# Altium project ACE_LED_Ring_V2.PrjPcb
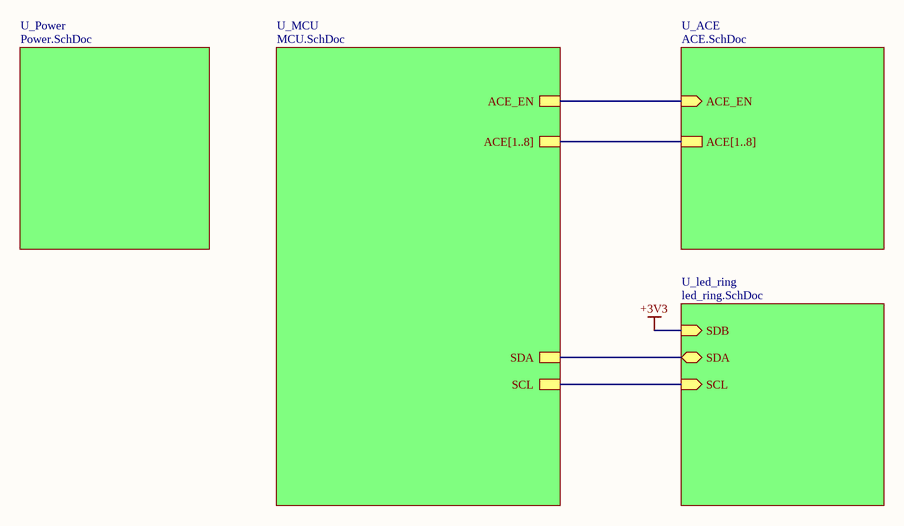
[diagram p0: overview.SchDoc]
5 sheets, 85 parts. Net scope: hierarchical (ports join the sheet entries above them; power ports are global).
Board file: PCB1.PcbDoc
Sheets:
  overview.SchDoc
    U_Power = Power.SchDoc
    U_ACE = ACE.SchDoc
    U_led_ring = led_ring.SchDoc
    U_MCU = MCU.SchDoc

## Sheet overview.SchDoc
size A4

### Sub-sheets
U_ACE = ACE.SchDoc: ACE_EN (in), ACE[1..8]
U_led_ring = led_ring.SchDoc: SDA (bidir), SCL (in), SDB (in)
U_MCU = MCU.SchDoc: ACE[1..8], ACE_EN, SDA, SCL
U_Power = Power.SchDoc: no entries

### Nets
NetB1_1: sheet U_led_ring/SDA, sheet U_MCU/SDA
NetB1_2: sheet U_ACE/ACE_EN, sheet U_MCU/ACE_EN
NetB1_28: sheet U_led_ring/SCL, sheet U_MCU/SCL

### Buses and harness runs
bus sheet U_ACE/ACE[1..8] = sheet U_MCU/ACE[1..8]

## Sheet Power.SchDoc
size A4
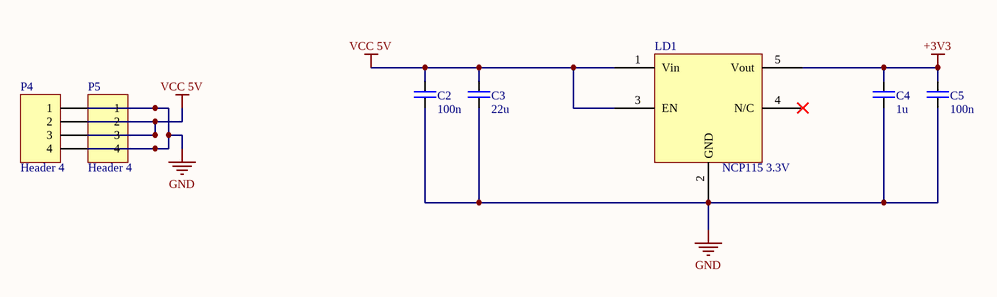
[diagram p1: Power.SchDoc]

### Parts
C2  100n  [R1005_0402i_L]
C3  22u  [C1608_0603I_L]
C4  1u  [R1005_0402i_L]
C5  100n  [R1005_0402i_L]
LD1  NCP115 3.3V  [TSOP95P280X110-6L]
P4  Header 4  [HDR1X4]
P5  Header 4  [HDR1X4]

### Nets
+3V3: C4.1 C5.1 LD1.5(Vout)
GND: C2.2 C3.2 C4.2 C5.2 LD1.2(GND) P4.1 P4.4 P5.1 P5.4
VCC 5V: C2.1 C3.1 LD1.1(Vin) LD1.3(EN) P4.2 P4.3 P5.2 P5.3

Not connected (* = marked no-connect by the designer): LD1 4(N/C)*

### Library data of the parts
C2-C5 = C: Capacitor
P4 P5 = Header 4: Header, 4-Pin; LatestRevisionDate: 17-Jul-2002; LatestRevisionNote: Re-released for DXP Platform.; Publisher: Altium Limited

## Sheet ACE.SchDoc
size A4
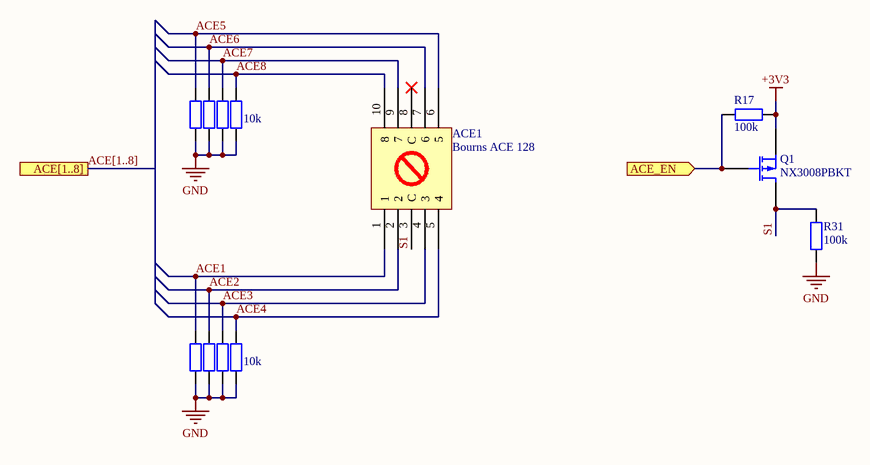
[diagram p2: ACE.SchDoc]

### Parts
ACE1  Bourns ACE 128  [Bourns ACE 128]
Q1  NX3008PBKT  [SOT95P230X110-3L]
R17  100k  [R1005_0402i_L]
R18  10k  [R1005_0402i_L]  (value not drawn)
R19  10k  [R1005_0402i_L]  (value not drawn)
R20  10k  [R1005_0402i_L]  (value not drawn)
R21  10k  [R1005_0402i_L]
R22  10k  [R1005_0402i_L]  (value not drawn)
R23  10k  [R1005_0402i_L]  (value not drawn)
R24  10k  [R1005_0402i_L]  (value not drawn)
R25  10k  [R1005_0402i_L]
R31  100k  [R1005_0402i_L]

### Ports
ACE[1..8], ACE_EN (in)

### Nets
+3V3: Q1.2(S) R17.2
GND: R18.1 R19.1 R20.1 R21.1 R22.1 R23.1 R24.1 R25.1 R31.1
ACE1: ACE1.1 R22.2
ACE2: ACE1.2 R23.2
ACE3: ACE1.4(3) R24.2
ACE4: ACE1.5(4) R25.2
ACE5: ACE1.6(5) R18.2
ACE6: ACE1.7(6) R19.2
ACE7: ACE1.9(7) R20.2
ACE8: ACE1.10(8) R21.2
S1: ACE1.3(C) Q1.3(D) R31.2
NetB1_2: Q1.1(G) R17.1 ; port ACE_EN

Not connected (* = marked no-connect by the designer): ACE1 8(C)*

### Buses and harness runs
bus ACE[1..8] = port ACE[1..8]

### Library data of the parts
Q1 = MOSFET-P: P-Channel MOSFET; Published: 8-Jun-2000; LatestRevisionDate: 17-Jul-2002; LatestRevisionNote: Re-released for DXP Platform.; PackageVersion: 1995/1996; PackageReference: E3; Publisher: Altium Limited; PackageDescription: TO, Flat Index; 3 In-Line, Axial Leads; Body Dia. 4.6mm; Lead Dia. 0.5 mm (max)
R17-R25 R31 = R

## Sheet led_ring.SchDoc
size A4
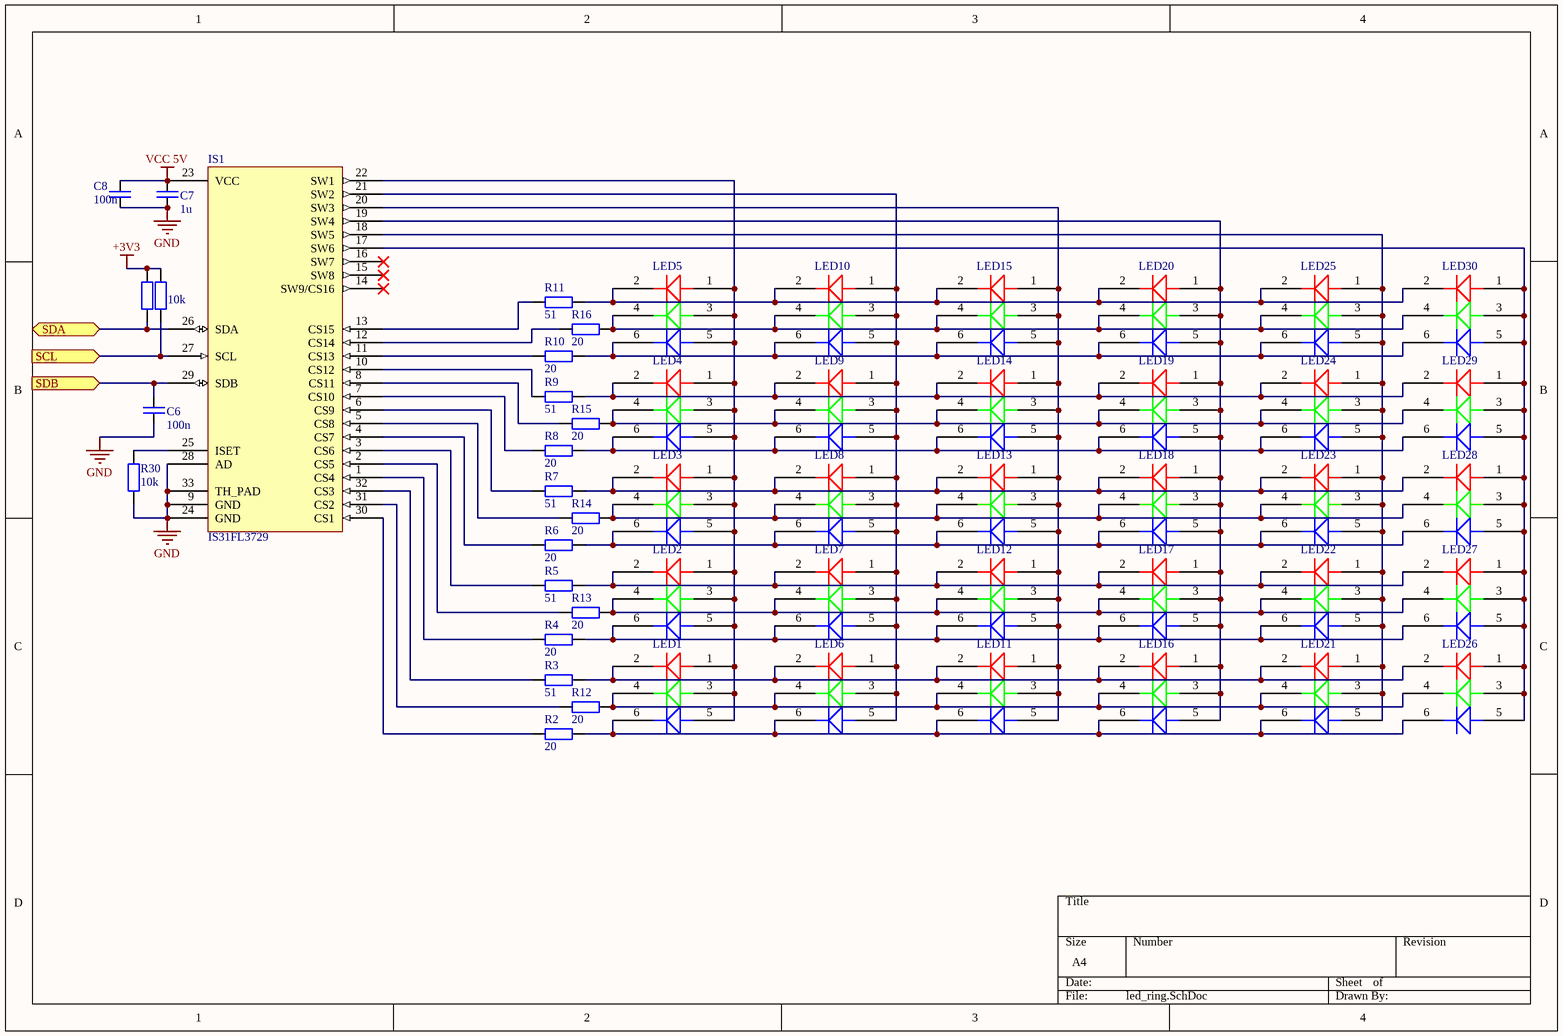
[diagram p3: led_ring.SchDoc]

### Parts
C6  100n  [R1005_0402i_L]
C7  1u  [C1608_0603I_L]
C8  100n  [R1005_0402i_L]
IS1  IS31FL3729  [QFN40P400X400X80_HS-33L]
LED1  SMB-LED  [ASMB-LED]  (value not drawn)
LED2  SMB-LED  [ASMB-LED]  (value not drawn)
LED3  SMB-LED  [ASMB-LED]  (value not drawn)
LED4  SMB-LED  [ASMB-LED]  (value not drawn)
LED5  SMB-LED  [ASMB-LED]  (value not drawn)
LED6  SMB-LED  [ASMB-LED]  (value not drawn)
LED7  SMB-LED  [ASMB-LED]  (value not drawn)
LED8  SMB-LED  [ASMB-LED]  (value not drawn)
LED9  SMB-LED  [ASMB-LED]  (value not drawn)
LED10  SMB-LED  [ASMB-LED]  (value not drawn)
LED11  SMB-LED  [ASMB-LED]  (value not drawn)
LED12  SMB-LED  [ASMB-LED]  (value not drawn)
LED13  SMB-LED  [ASMB-LED]  (value not drawn)
LED14  SMB-LED  [ASMB-LED]  (value not drawn)
LED15  SMB-LED  [ASMB-LED]  (value not drawn)
LED16  SMB-LED  [ASMB-LED]  (value not drawn)
LED17  SMB-LED  [ASMB-LED]  (value not drawn)
LED18  SMB-LED  [ASMB-LED]  (value not drawn)
LED19  SMB-LED  [ASMB-LED]  (value not drawn)
LED20  SMB-LED  [ASMB-LED]  (value not drawn)
LED21  SMB-LED  [ASMB-LED]  (value not drawn)
LED22  SMB-LED  [ASMB-LED]  (value not drawn)
LED23  SMB-LED  [ASMB-LED]  (value not drawn)
LED24  SMB-LED  [ASMB-LED]  (value not drawn)
LED25  SMB-LED  [ASMB-LED]  (value not drawn)
LED26  SMB-LED  [ASMB-LED]  (value not drawn)
LED27  SMB-LED  [ASMB-LED]  (value not drawn)
LED28  SMB-LED  [ASMB-LED]  (value not drawn)
LED29  SMB-LED  [ASMB-LED]  (value not drawn)
LED30  SMB-LED  [ASMB-LED]  (value not drawn)
R2  20  [R1005_0402i_L]
R3  51  [R1005_0402i_L]
R4  20  [R1005_0402i_L]
R5  51  [R1005_0402i_L]
R6  20  [R1005_0402i_L]
R7  51  [R1005_0402i_L]
R8  20  [R1005_0402i_L]
R9  51  [R1005_0402i_L]
R10  20  [R1005_0402i_L]
R11  51  [R1005_0402i_L]
R12  20  [R1005_0402i_L]
R13  20  [R1005_0402i_L]
R14  20  [R1005_0402i_L]
R15  20  [R1005_0402i_L]
R16  20  [R1005_0402i_L]
R27  10k  [R1005_0402i_L]  (value not drawn)
R28  10k  [R1005_0402i_L]
R30  10k  [R1005_0402i_L]

### Ports
SCL (in), SDA (bidir), SDB (in)

### Nets
+3V3: C6.1 IS1.29(SDB) R27.1 R28.1 ; port SDB
GND: C6.2 C7.2 C8.2 IS1.9(GND) IS1.24(GND) IS1.28(AD) IS1.33(TH_PAD) R30.2
VCC 5V: C7.1 C8.1 IS1.23(VCC)
NetB1_1: IS1.26(SDA) R27.2 ; port SDA
NetB1_28: IS1.27(SCL) R28.2 ; port SCL
NetIS1_1: IS1.1(CS4) R4.1
NetIS1_2: IS1.2(CS5) R13.1
NetIS1_3: IS1.3(CS6) R5.1
NetIS1_4: IS1.4(CS7) R6.1
NetIS1_5: IS1.5(CS8) R14.1
NetIS1_6: IS1.6(CS9) R7.1
NetIS1_7: IS1.7(CS10) R8.1
NetIS1_8: IS1.8(CS11) R15.1
NetIS1_10: IS1.10(CS12) R9.1
NetIS1_11: IS1.11(CS13) R10.1
NetIS1_12: IS1.12(CS14) R16.1
NetIS1_13: IS1.13(CS15) R11.1
NetIS1_17: IS1.17(SW6) LED26.1 LED26.3 LED26.5 LED27.1 LED27.3 LED27.5 LED28.1 LED28.3 LED28.5 LED29.1 LED29.3 LED29.5 LED30.1 LED30.3 LED30.5
NetIS1_18: IS1.18(SW5) LED21.1 LED21.3 LED21.5 LED22.1 LED22.3 LED22.5 LED23.1 LED23.3 LED23.5 LED24.1 LED24.3 LED24.5 LED25.1 LED25.3 LED25.5
NetIS1_19: IS1.19(SW4) LED16.1 LED16.3 LED16.5 LED17.1 LED17.3 LED17.5 LED18.1 LED18.3 LED18.5 LED19.1 LED19.3 LED19.5 LED20.1 LED20.3 LED20.5
NetIS1_20: IS1.20(SW3) LED11.1 LED11.3 LED11.5 LED12.1 LED12.3 LED12.5 LED13.1 LED13.3 LED13.5 LED14.1 LED14.3 LED14.5 LED15.1 LED15.3 LED15.5
NetIS1_21: IS1.21(SW2) LED6.1 LED6.3 LED6.5 LED7.1 LED7.3 LED7.5 LED8.1 LED8.3 LED8.5 LED9.1 LED9.3 LED9.5 LED10.1 LED10.3 LED10.5
NetIS1_22: IS1.22(SW1) LED1.1 LED1.3 LED1.5 LED2.1 LED2.3 LED2.5 LED3.1 LED3.3 LED3.5 LED4.1 LED4.3 LED4.5 LED5.1 LED5.3 LED5.5
NetIS1_25: IS1.25(ISET) R30.1
NetIS1_30: IS1.30(CS1) R2.1
NetIS1_31: IS1.31(CS2) R12.1
NetIS1_32: IS1.32(CS3) R3.1
NetLED1_2: LED1.2 LED6.2 LED11.2 LED16.2 LED21.2 LED26.2 R3.2
NetLED1_4: LED1.4 LED6.4 LED11.4 LED16.4 LED21.4 LED26.4 R12.2
NetLED1_6: LED1.6 LED6.6 LED11.6 LED16.6 LED21.6 LED26.6 R2.2
NetLED2_2: LED2.2 LED7.2 LED12.2 LED17.2 LED22.2 LED27.2 R5.2
NetLED2_4: LED2.4 LED7.4 LED12.4 LED17.4 LED22.4 LED27.4 R13.2
NetLED2_6: LED2.6 LED7.6 LED12.6 LED17.6 LED22.6 LED27.6 R4.2
NetLED3_2: LED3.2 LED8.2 LED13.2 LED18.2 LED23.2 LED28.2 R7.2
NetLED3_4: LED3.4 LED8.4 LED13.4 LED18.4 LED23.4 LED28.4 R14.2
NetLED3_6: LED3.6 LED8.6 LED13.6 LED18.6 LED23.6 LED28.6 R6.2
NetLED4_2: LED4.2 LED9.2 LED14.2 LED19.2 LED24.2 LED29.2 R9.2
NetLED4_4: LED4.4 LED9.4 LED14.4 LED19.4 LED24.4 LED29.4 R15.2
NetLED4_6: LED4.6 LED9.6 LED14.6 LED19.6 LED24.6 LED29.6 R8.2
NetLED5_2: LED5.2 LED10.2 LED15.2 LED20.2 LED25.2 LED30.2 R11.2
NetLED5_4: LED5.4 LED10.4 LED15.4 LED20.4 LED25.4 LED30.4 R16.2
NetLED5_6: LED5.6 LED10.6 LED15.6 LED20.6 LED25.6 LED30.6 R10.2

Not connected (* = marked no-connect by the designer): IS1 14(SW9/CS16)* 15(SW8)* 16(SW7)*

### Library data of the parts
C6-C8 = C: Capacitor
LED1-LED30 = ASMB-LED
R2-R16 R27 R28 R30 = R

## Sheet MCU.SchDoc
size A4
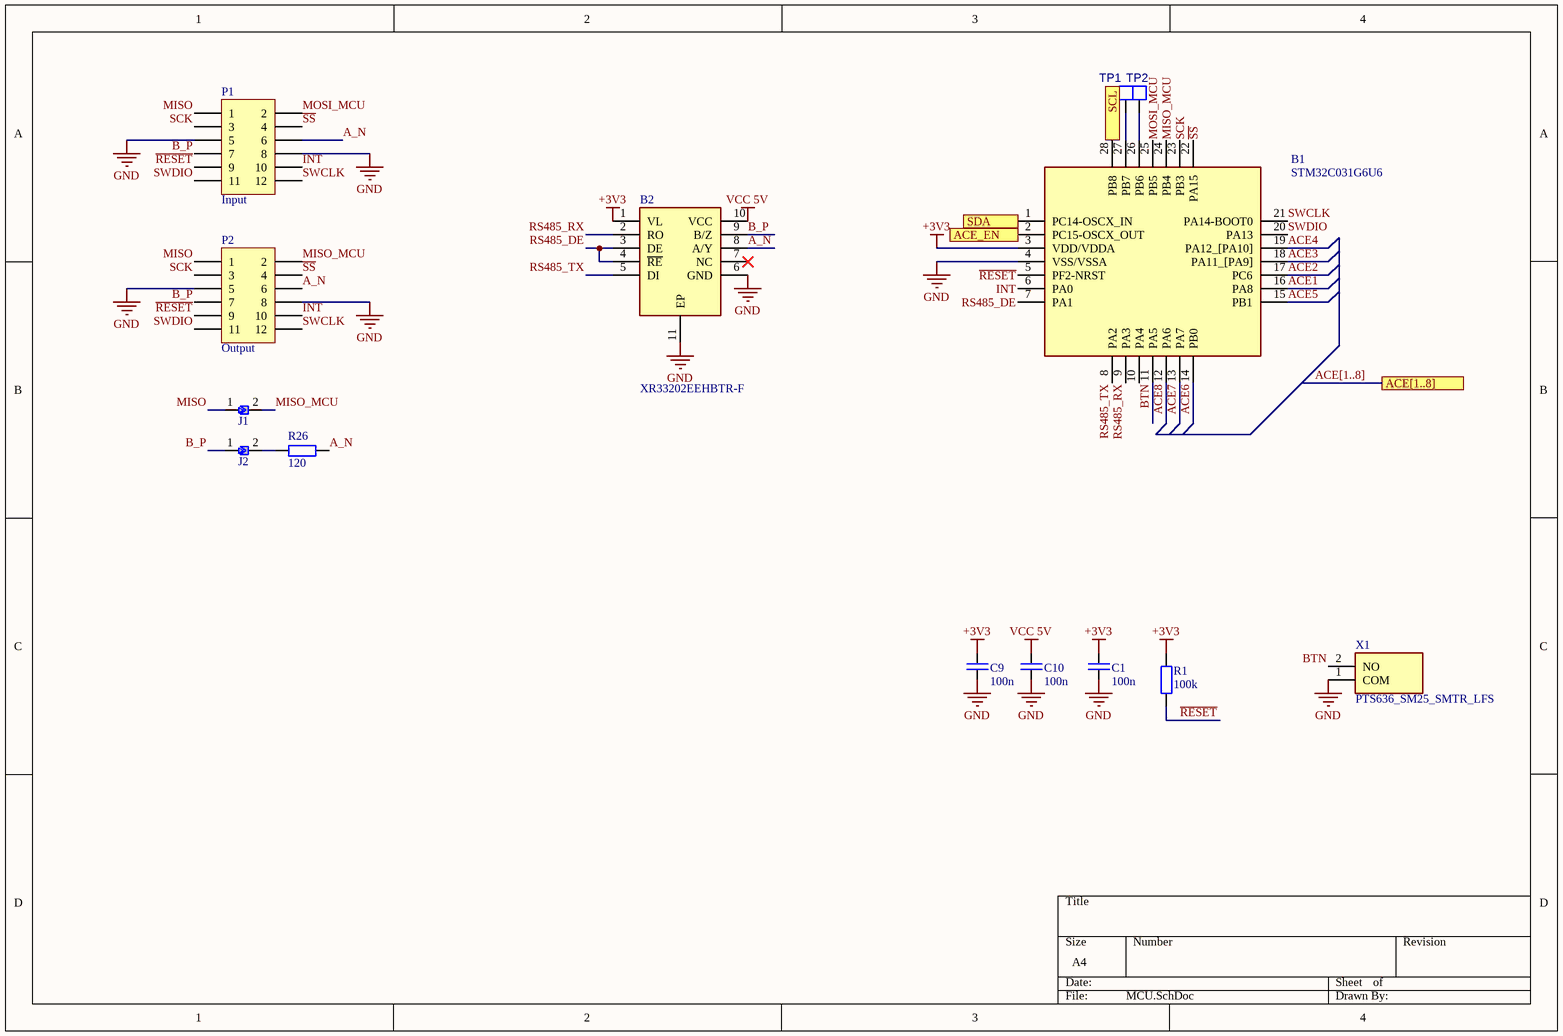
[diagram p4: MCU.SchDoc]

### Parts
B1  STM32C031G6U6  [QFN50P400X400X60-28N-D]
B2  XR33202EEHBTR-F  [SON50P300X300X80-11N-D]
C1  100n  [R1005_0402i_L]
C9  100n  [R1005_0402i_L]
C10  100n  [R1005_0402i_L]
J1  solder_jumper  [solder_jumper_triangle]  (value not drawn)
J2  solder_jumper  [solder_jumper_triangle]  (value not drawn)
P1  Input  [1.27mm SMD conn]
P2  Output  [1.27mm SMD conn]
R1  100k  [R1005_0402i_L]
R26  120  [R1005_0402i_L]
TP1  PAD  [PAD]  (value not drawn)
TP2  PAD  [PAD]  (value not drawn)
X1  PTS636_SM25_SMTR_LFS  [PTS636SM25SMTRLFS]

### Ports
ACE[1..8], ACE_EN, SCL, SDA

### Nets
+3V3: B1.3(VDD/VDDA) B2.1(VL) C1.1 C9.1 R1.1
GND: B1.4(VSS/VSSA) B2.6(GND) B2.11(EP) C1.2 C9.2 C10.2 P1.5 P1.8 P2.5 P2.8 X1.1(COM)
VCC 5V: B2.10(VCC) C10.1
A_N: B2.8(A/Y) P1.6 P2.6 R26.2
ACE1: B1.16(PA8)
ACE2: B1.17(PC6)
ACE3: B1.18(PA11_[PA9])
ACE4: B1.19(PA12_[PA10])
ACE5: B1.15(PB1)
ACE6: B1.14(PB0)
ACE7: B1.13(PA7)
ACE8: B1.12(PA6)
B_P: B2.9(B/Z) J2.1 P1.7 P2.7
BTN: B1.11(PA5) X1.2(NO)
INT: B1.6(PA0) P1.10 P2.10
MISO: J1.1 P1.1 P2.1
MISO_MCU: B1.24(PB4) J1.2 P2.2
MOSI_MCU: B1.25(PB5) P1.2
~{RESET}: B1.5(PF2-NRST) P1.9 P2.9 R1.2
RS485_DE: B1.7(PA1) B2.3(DE) B2.4(~{RE})
RS485_RX: B1.9(PA3) B2.2(RO)
RS485_TX: B1.8(PA2) B2.5(DI)
~{SS}: B1.22(PA15) P1.4 P2.4
SCK: B1.23(PB3) P1.3 P2.3
SWCLK: B1.21(PA14-BOOT0) P1.12 P2.12
SWDIO: B1.20(PA13) P1.11 P2.11
NetB1_1: B1.1(PC14-OSCX_IN) ; port SDA
NetB1_2: B1.2(PC15-OSCX_OUT) ; port ACE_EN
NetB1_26: B1.26(PB6) TP2.1
NetB1_27: B1.27(PB7) TP1.1
NetB1_28: B1.28(PB8) ; port SCL
NetJ2_2: J2.2 R26.1

Not connected (* = marked no-connect by the designer): B1 10(PA4); B2 7(NC)*

### Buses and harness runs
bus ACE[1..8] = port ACE[1..8]

### Library data of the parts
B1 = STM32C031G6U6: Mainstream Arm Cortex-M0+ MCU with 32 Kbytes of Flash memory, 12 Kbytes RAM, 48 MHz CPU, 2x USART, timers, ADC, comm. I/F, 2-3.6V; Manufacturer_Name: STMicroelectronics; Geometry.Height: 0.6mm; Mouser Part Number: 511-STM32C031G6U6; Mouser Price/Stock: https://www.mouser.co.uk/ProductDetail/STMicroelectronics/STM32C031G6U6?qs=IPgv5n7u5QZqRf3nOTChhw%3D%3D; Manufacturer_Part_Number: STM32C031G6U6; Datasheet Link: https://www.st.com/resource/en/datasheet/stm32c031c4.pdf
B2 = XR33202EEHBTR-F: RS-422/RS-485 Interface IC Wide Supply Trans with I/O Interface; Manufacturer_Name: MaxLinear, Inc.; Geometry.Height: 0.8mm; Mouser Part Number: 701-XR33202EEHBTR-F; Mouser Price/Stock: https://www.mouser.co.uk/ProductDetail/MaxLinear/XR33202EEHBTR-F?qs=GtWAI9k6EVi4nRW8bj1LFw%3D%3D; Manufacturer_Part_Number: XR33202EEHBTR-F; Datasheet Link: https://www.maxlinear.com/ds/xr33202.pdf
C1 C9 C10 = C: Capacitor
P1 P2 = Header 6X2: Header, 6-Pin, Dual row; LatestRevisionDate: 17-Jul-2002; LatestRevisionNote: Re-released for DXP Platform.; Publisher: Altium Limited
R1 R26 = R
X1 = PTS636_SM25_SMTR_LFS: Tactile Switches Tact 50mA 12VDC, 6.0x3.5, 2.5mm H, 180gf, G leads, No ground pin, White Actuator; Manufacturer_Name: C & K COMPONENTS; Manufacturer_Part_Number: PTS636 SM25 SMTR LFS; Geometry.Height: 2.7mm; Mouser Part Number: 611-PTS636SM25SMTRLF; Mouser Price/Stock: https://www.mouser.co.uk/ProductDetail/CK/PTS636-SM25-SMTR-LFS?qs=vLWxofP3U2yIXR4iooxesw%3D%3D; Datasheet Link: https://componentsearchengine.com/Datasheets/1/PTS636 SM25 SMTR LFS.pdf

## Nets that join several sheets
+3V3: Power (C4.1 C5.1 LD1.5), ACE (Q1.2 R17.2), led_ring (C6.1 IS1.29 R27.1 R28.1), MCU (5 pins)
GND: Power (9 pins), ACE (9 pins), led_ring (8 pins), MCU (11 pins)
VCC 5V: Power (8 pins), led_ring (C7.1 C8.1 IS1.23), MCU (B2.10 C10.1)
ACE1: ACE (ACE1.1 R22.2), MCU (B1.16)
ACE2: ACE (ACE1.2 R23.2), MCU (B1.17)
ACE3: ACE (ACE1.4 R24.2), MCU (B1.18)
ACE4: ACE (ACE1.5 R25.2), MCU (B1.19)
ACE5: ACE (ACE1.6 R18.2), MCU (B1.15)
ACE6: ACE (ACE1.7 R19.2), MCU (B1.14)
ACE7: ACE (ACE1.9 R20.2), MCU (B1.13)
ACE8: ACE (ACE1.10 R21.2), MCU (B1.12)
NetB1_1: led_ring (IS1.26 R27.2), MCU (B1.1)
NetB1_2: ACE (Q1.1 R17.1), MCU (B1.2)
NetB1_28: led_ring (IS1.27 R28.2), MCU (B1.28)